# Altium schematic sheet Connectivity.SchDoc
size A4; SheetNumber: 4; SheetTotal: 4
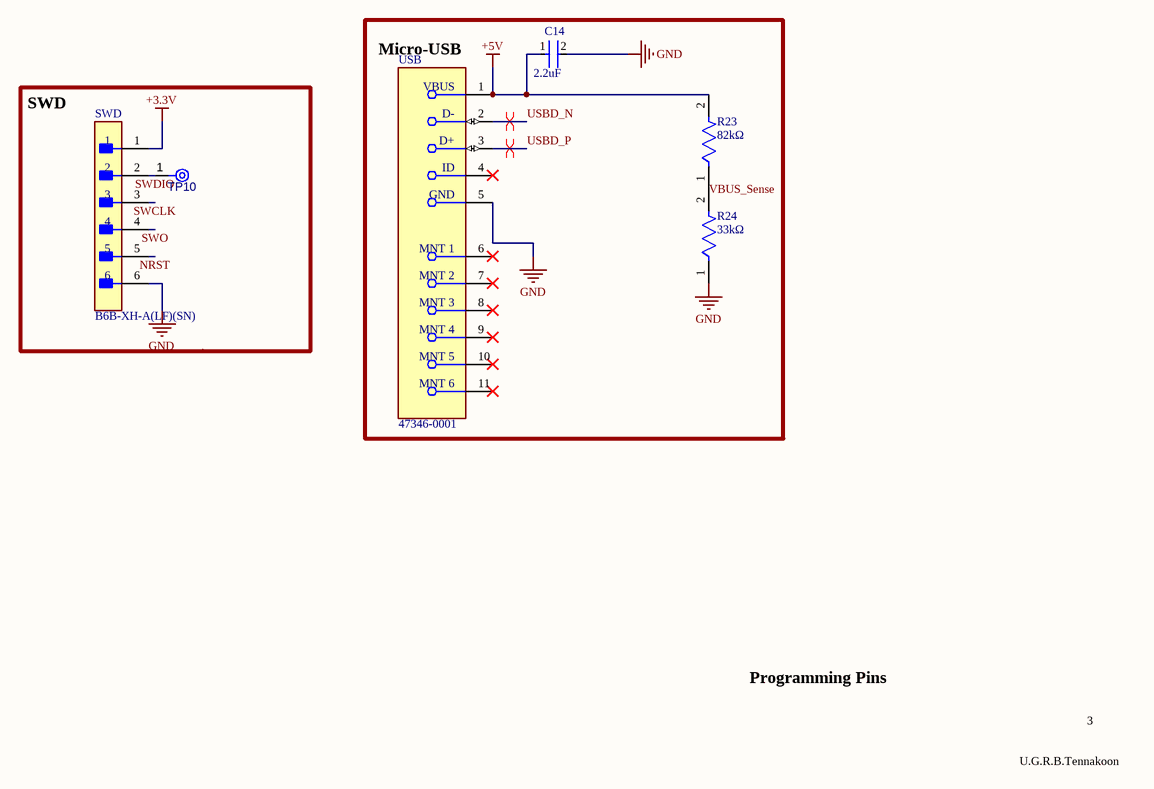
[diagram p0: Connectivity.SchDoc]

## Parts
C14  2.2uF  [FP-C1210C225K1RACAUTO-MFG]
R23  82kΩ  [FP-SR0805-MFG]
R24  33kΩ  [FP-SR0805-MFG]
SWD  B6B-XH-A(LF)(SN)  [FP-B6B-XH-A_LF_SN-MFG]  (no BOM)
TP10  TPAD6R  [TP06R]  (value not drawn)  (no BOM)
USB  47346-0001  [FP-473460001-MFG]  (no BOM)

## Nets
+3.3V: SWD.1
+5V: C14.1 R23.2 USB.1(VBUS)
GND: C14.2 R24.1 SWD.6 USB.5(GND)
NRST: SWD.5
SWCLK: SWD.3
SWDIO: SWD.2 TP10.1(TP)
SWO: SWD.4
USBD_N: USB.2(D-)
USBD_P: USB.3(D+)
VBUS_Sense: R23.1 R24.2

Not connected (* = marked no-connect by the designer): USB 4(ID)* 6(MNT_1)* 7(MNT_2)* 8(MNT_3)* 9(MNT_4)* 10(MNT_5)* 11(MNT_6)*

## Layout directives
differential pair: USBD_N, USBD_P

## Notes on the sheet
- (near USB) Micro-USB
- SWD
- Programming Pins
- 3
- U.G.R.B.Tennakoon

## Library data of the parts
C14 = CMP-03020-034647-1: C1210C225K1RACAUTOCAP CER 2.2UF 100V X7R 1210; Tolerance: 10%; Dielectric Material: Ceramic; Capacitance: 2.2uF; Voltage Rating: 100V; Length: 0.126inch; REACH SVHC: No SVHC; Width: 0.098inch; Mount: Surface Mount; Case/Package: 1210; Dielectric: X7R; Min Operating Temperature: -55°C; Case Code (Metric): 3225; RoHS Compliant: Yes; Packaging: Cut Tape; Case Code (Imperial): 1210; Ratings: AEC-Q200; Max Operating Temperature: 125°C; Voltage Rating (DC): 100V
R23 = CMP-03412-005404-1: 0805W8F8202T5E; Manufacturer Part Number: SR0805FR-4710KL; Manufacturer: Yageo; Value: 10KΩ; Power Rating: 0.5W; Voltage Rating: 150V; Tolerance: 0.01; Automotive Grade: Grade 0; RoHS: TRUE; Package: SR0805; Temperature: -55°C to +155°C; Composition: Thick Film; Lead Free: Yes; Ipc Land Pattern Name: RESC200125X50; Footprint Url: http://www.yageo.com/exep/pages/download/literatures/PYu-R_Mount_10.pdf; ComponentLink2URL: http://www.yageo.com/documents/recent/PYu-SR_D_F%20tol_RoHS_L_3.pdf; Series: SR; Resistance: 10KΩ; Device Class L3: Chip SMD Resistors; Device Class L2: Resistors; Digikey Description: RES SMD 0805 1/2W 1% 10K OHM; Category: Res; Temperature Range Low: -55°C; ComponentLink2Description: Datasheet; Automotive: Yes; Height: 0.6mm; Octopart: https://octopart.com/sr0805fr-4710kl-yageo-91478094; Device Class L1: Passive Components; Temperature Range High: +155°C
R24 = CMP-03412-005404-1: 0805W8F3302T5E; Manufacturer Part Number: SR0805FR-4710KL; Manufacturer: Yageo; Value: 10KΩ; Power Rating: 0.5W; Voltage Rating: 150V; Tolerance: 0.01; Automotive Grade: Grade 0; RoHS: TRUE; Package: SR0805; Temperature: -55°C to +155°C; Composition: Thick Film; Lead Free: Yes; Ipc Land Pattern Name: RESC200125X50; Footprint Url: http://www.yageo.com/exep/pages/download/literatures/PYu-R_Mount_10.pdf; ComponentLink2URL: http://www.yageo.com/documents/recent/PYu-SR_D_F%20tol_RoHS_L_3.pdf; Series: SR; Resistance: 10KΩ; Device Class L3: Chip SMD Resistors; Device Class L2: Resistors; Digikey Description: RES SMD 0805 1/2W 1% 10K OHM; Category: Res; Temperature Range Low: -55°C; ComponentLink2Description: Datasheet; Automotive: Yes; Height: 0.6mm; Octopart: https://octopart.com/sr0805fr-4710kl-yageo-91478094; Device Class L1: Passive Components; Temperature Range High: +155°C
SWD = CMP-17439-000076-1: CONN HEADER VERT 6POS 2.5MM
TP10 = CMP-00028-00002-3: 0.6mm round; Pins: 1
USB = CMP-002-00071-1: Micro-USB B Receptacle with Flange, Bottom Mount, Surface Mount, Lead-Free; Connector Type: Receptacle, USB; Gender: Female; Voltage Rating: 30V; Min Operating Temperature: -30°C; Pins: 6; Max Operating Temperature: 85°C; Mounting Technology: Surface Mount